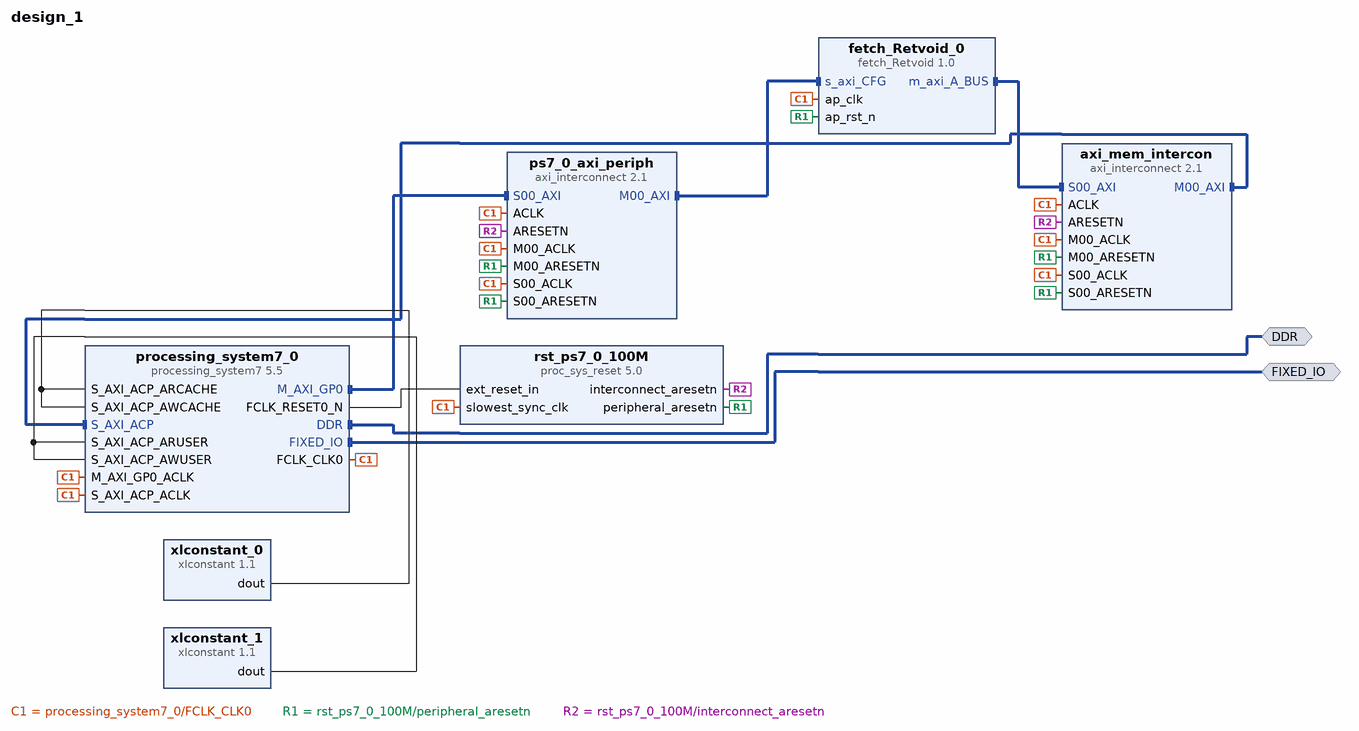
[diagram p0: block diagram of the top level]
# Vivado block design design_1, xc7z020clg400-1, Vivado 2016.3
create_bd_design design_1

create_bd_intf_port -mode Master -vlnv xilinx.com:interface:ddrx_rtl:1.0 DDR
create_bd_intf_port -mode Master -vlnv xilinx.com:display_processing_system7:fixedio_rtl:1.0 FIXED_IO

create_bd_cell -type ip -vlnv xilinx.com:ip:processing_system7:5.5 processing_system7_0
set_property -dict [list \
  CONFIG.PCW_UIPARAM_DDR_FREQ_MHZ 525 \
  CONFIG.PCW_CRYSTAL_PERIPHERAL_FREQMHZ 50 \
  CONFIG.PCW_APU_PERIPHERAL_FREQMHZ 650 \
  CONFIG.PCW_SDIO_PERIPHERAL_FREQMHZ 50 \
  CONFIG.PCW_UART_PERIPHERAL_FREQMHZ 100 \
  CONFIG.PCW_FPGA0_PERIPHERAL_FREQMHZ 100 \
  CONFIG.PCW_FPGA1_PERIPHERAL_FREQMHZ 50 \
  CONFIG.PCW_USE_S_AXI_ACP 1 \
  CONFIG.PCW_M_AXI_GP0_FREQMHZ 10 \
  CONFIG.PCW_USE_DEFAULT_ACP_USER_VAL 1 \
  CONFIG.PCW_PERIPHERAL_BOARD_PRESET None \
  CONFIG.PCW_PRESET_BANK1_VOLTAGE {LVCMOS 1.8V} \
  CONFIG.PCW_UIPARAM_DDR_BUS_WIDTH {16 Bit} \
  CONFIG.PCW_UIPARAM_DDR_PARTNO {MT41J256M16 RE-125} \
  CONFIG.PCW_QSPI_PERIPHERAL_ENABLE 1 \
  CONFIG.PCW_QSPI_QSPI_IO {MIO 1 .. 6} \
  CONFIG.PCW_QSPI_GRP_SINGLE_SS_ENABLE 1 \
  CONFIG.PCW_QSPI_GRP_SINGLE_SS_IO {MIO 1 .. 6} \
  CONFIG.PCW_QSPI_GRP_FBCLK_ENABLE 1 \
  CONFIG.PCW_QSPI_GRP_FBCLK_IO {MIO 8} \
  CONFIG.PCW_ENET0_PERIPHERAL_ENABLE 1 \
  CONFIG.PCW_ENET0_ENET0_IO {MIO 16 .. 27} \
  CONFIG.PCW_ENET0_GRP_MDIO_ENABLE 1 \
  CONFIG.PCW_ENET0_GRP_MDIO_IO {MIO 52 .. 53} \
  CONFIG.PCW_ENET_RESET_ENABLE 1 \
  CONFIG.PCW_ENET_RESET_SELECT {Share reset pin} \
  CONFIG.PCW_ENET0_RESET_ENABLE 1 \
  CONFIG.PCW_ENET0_RESET_IO {MIO 9} \
  CONFIG.PCW_SD0_PERIPHERAL_ENABLE 1 \
  CONFIG.PCW_SD0_SD0_IO {MIO 40 .. 45} \
  CONFIG.PCW_SD0_GRP_CD_ENABLE 1 \
  CONFIG.PCW_SD0_GRP_CD_IO {MIO 47} \
  CONFIG.PCW_SD0_GRP_WP_ENABLE 0 \
  CONFIG.PCW_UART0_PERIPHERAL_ENABLE 1 \
  CONFIG.PCW_UART0_UART0_IO {MIO 14 .. 15} \
  CONFIG.PCW_UART1_PERIPHERAL_ENABLE 0 \
  CONFIG.PCW_USB0_PERIPHERAL_ENABLE 1 \
  CONFIG.PCW_USB0_USB0_IO {MIO 28 .. 39} \
  CONFIG.PCW_USB_RESET_ENABLE 1 \
  CONFIG.PCW_USB_RESET_SELECT {Share reset pin} \
  CONFIG.PCW_USB0_RESET_ENABLE 1 \
  CONFIG.PCW_USB0_RESET_IO {MIO 46} \
  CONFIG.PCW_GPIO_MIO_GPIO_ENABLE 1 \
  CONFIG.PCW_GPIO_MIO_GPIO_IO MIO \
] [get_bd_cells processing_system7_0]
# 484 more settings of processing_system7_0 are not shown: defaults, MIO pin electricals, DDR timing, and values the tool derives
create_bd_cell -type ip -vlnv xilinx.com:ip:axi_interconnect:2.1 axi_mem_intercon
set_property -dict {CONFIG.NUM_MI 1} [get_bd_cells axi_mem_intercon]
create_bd_cell -type ip -vlnv xilinx.com:ip:proc_sys_reset:5.0 rst_ps7_0_100M
create_bd_cell -type ip -vlnv xilinx.com:ip:axi_interconnect:2.1 ps7_0_axi_periph
set_property -dict {CONFIG.NUM_MI 1} [get_bd_cells ps7_0_axi_periph]
create_bd_cell -type ip -vlnv xilinx.com:ip:xlconstant:1.1 xlconstant_0
set_property -dict {CONFIG.CONST_WIDTH 4 CONFIG.CONST_VAL 15} [get_bd_cells xlconstant_0]
create_bd_cell -type ip -vlnv xilinx.com:ip:xlconstant:1.1 xlconstant_1
set_property -dict {CONFIG.CONST_WIDTH 5 CONFIG.CONST_VAL 31} [get_bd_cells xlconstant_1]
create_bd_cell -type ip -vlnv xilinx.com:hls:fetch_Retvoid:1.0 fetch_Retvoid_0

# ---- connections ----

connect_bd_intf_net [get_bd_intf_pins axi_mem_intercon/M00_AXI] [get_bd_intf_pins processing_system7_0/S_AXI_ACP]
connect_bd_intf_net [get_bd_intf_pins processing_system7_0/M_AXI_GP0] [get_bd_intf_pins ps7_0_axi_periph/S00_AXI]
connect_bd_intf_net [get_bd_intf_pins ps7_0_axi_periph/M00_AXI] [get_bd_intf_pins fetch_Retvoid_0/s_axi_CFG]
connect_bd_intf_net [get_bd_intf_pins fetch_Retvoid_0/m_axi_A_BUS] [get_bd_intf_pins axi_mem_intercon/S00_AXI]
connect_bd_intf_net [get_bd_intf_ports DDR] [get_bd_intf_pins processing_system7_0/DDR]
connect_bd_intf_net [get_bd_intf_ports FIXED_IO] [get_bd_intf_pins processing_system7_0/FIXED_IO]
connect_bd_net [get_bd_pins processing_system7_0/FCLK_CLK0] \
  [get_bd_pins rst_ps7_0_100M/slowest_sync_clk] [get_bd_pins processing_system7_0/S_AXI_ACP_ACLK] \
  [get_bd_pins processing_system7_0/M_AXI_GP0_ACLK] [get_bd_pins axi_mem_intercon/S00_ACLK] \
  [get_bd_pins axi_mem_intercon/ACLK] [get_bd_pins axi_mem_intercon/M00_ACLK] [get_bd_pins ps7_0_axi_periph/S00_ACLK] \
  [get_bd_pins ps7_0_axi_periph/ACLK] [get_bd_pins ps7_0_axi_periph/M00_ACLK] [get_bd_pins fetch_Retvoid_0/ap_clk]
connect_bd_net [get_bd_pins processing_system7_0/FCLK_RESET0_N] [get_bd_pins rst_ps7_0_100M/ext_reset_in]
connect_bd_net [get_bd_pins rst_ps7_0_100M/peripheral_aresetn] \
  [get_bd_pins axi_mem_intercon/S00_ARESETN] [get_bd_pins axi_mem_intercon/M00_ARESETN] \
  [get_bd_pins ps7_0_axi_periph/S00_ARESETN] [get_bd_pins ps7_0_axi_periph/M00_ARESETN] \
  [get_bd_pins fetch_Retvoid_0/ap_rst_n]
connect_bd_net [get_bd_pins rst_ps7_0_100M/interconnect_aresetn] [get_bd_pins axi_mem_intercon/ARESETN] [get_bd_pins ps7_0_axi_periph/ARESETN]
connect_bd_net [get_bd_pins xlconstant_0/dout] \
  [get_bd_pins processing_system7_0/S_AXI_ACP_AWCACHE] [get_bd_pins processing_system7_0/S_AXI_ACP_ARCACHE]
connect_bd_net [get_bd_pins xlconstant_1/dout] [get_bd_pins processing_system7_0/S_AXI_ACP_ARUSER] [get_bd_pins processing_system7_0/S_AXI_ACP_AWUSER]

# ---- address map ----
assign_bd_address -offset 0x00000000 -range 512M -target_address_space [get_bd_addr_spaces fetch_Retvoid_0/Data_m_axi_A_BUS] [get_bd_addr_segs processing_system7_0/S_AXI_ACP/ACP_DDR_LOWOCM]
assign_bd_address -offset 0x40000000 -range 1G -target_address_space [get_bd_addr_spaces fetch_Retvoid_0/Data_m_axi_A_BUS] [get_bd_addr_segs processing_system7_0/S_AXI_ACP/ACP_M_AXI_GP0]
assign_bd_address -offset 0xE0000000 -range 4M -target_address_space [get_bd_addr_spaces fetch_Retvoid_0/Data_m_axi_A_BUS] [get_bd_addr_segs processing_system7_0/S_AXI_ACP/ACP_IOP]
assign_bd_address -offset 0xFC000000 -range 16M -target_address_space [get_bd_addr_spaces fetch_Retvoid_0/Data_m_axi_A_BUS] [get_bd_addr_segs processing_system7_0/S_AXI_ACP/ACP_QSPI_LINEAR]
assign_bd_address -offset 0x43C00000 -range 64K -target_address_space [get_bd_addr_spaces processing_system7_0/Data] [get_bd_addr_segs fetch_Retvoid_0/s_axi_CFG/Reg]

validate_bd_design
save_bd_design
